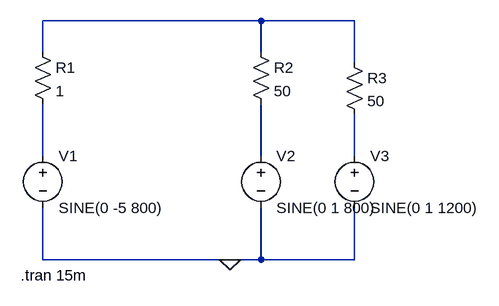
[diagram p0: schematic pruebas-mixer.asc]
pruebas-mixer.asc, the LTspice schematic file:
Version 4
SHEET 1 880 680
WIRE 352 -96 16 -96
WIRE 496 -96 352 -96
WIRE 16 -48 16 -96
WIRE 352 -48 352 -96
WIRE 496 -32 496 -96
WIRE 16 112 16 32
WIRE 352 112 352 32
WIRE 496 112 496 48
WIRE 16 272 16 192
WIRE 304 272 16 272
WIRE 352 272 352 192
WIRE 352 272 304 272
WIRE 496 272 496 192
WIRE 496 272 352 272
FLAG 304 272 0
SYMBOL voltage 16 96 R0
WINDOW 123 0 0 Left 0
WINDOW 39 0 0 Left 0
SYMATTR InstName V1
SYMATTR Value SINE(0 -5 800)
SYMBOL voltage 352 96 R0
WINDOW 123 0 0 Left 0
WINDOW 39 0 0 Left 0
SYMATTR InstName V2
SYMATTR Value SINE(0 1 800)
SYMBOL voltage 496 96 R0
WINDOW 123 0 0 Left 0
WINDOW 39 0 0 Left 0
SYMATTR InstName V3
SYMATTR Value SINE(0 1 1200)
SYMBOL res 0 -64 R0
SYMATTR InstName R1
SYMATTR Value 1
SYMBOL res 336 -64 R0
SYMATTR InstName R2
SYMATTR Value 50
SYMBOL res 480 -48 R0
SYMATTR InstName R3
SYMATTR Value 50
TEXT -18 296 Left 2 !.tran 15m

The netlist it stands for:
* pruebas-mixer.asc
V1 N002 0 SINE(0 -5 800)
V2 N003 0 SINE(0 1 800)
V3 N004 0 SINE(0 1 1200)
R1 N001 N002 1
R2 N001 N003 50
R3 N001 N004 50
.tran 15m
.backanno
.end